# Altium schematic sheet DCDC_Hall.SchDoc
size 420 x 297 mm; Address1: Address1; Address2: Address2; Address3: Address3; Address4: Address4; SheetNumber: 1; Scale: 1:1; Разраб.: Иванов; Обозначение документа: АБВГ.123456.001 Э3; Пров.: Петров; Утв.: Сидоров; Наименование организации: ОАО "Концерн "МПО-Гидроприбор"; Перв. применение: АБВГ.123456.000; Наименование изделия 1: Плата; Наименование изделия 2: Схема электрическая; Наименование изделия 3: принципиальная; Нач. отд.: Нач. отд.; Фамилия нач. отд.: Сидоров
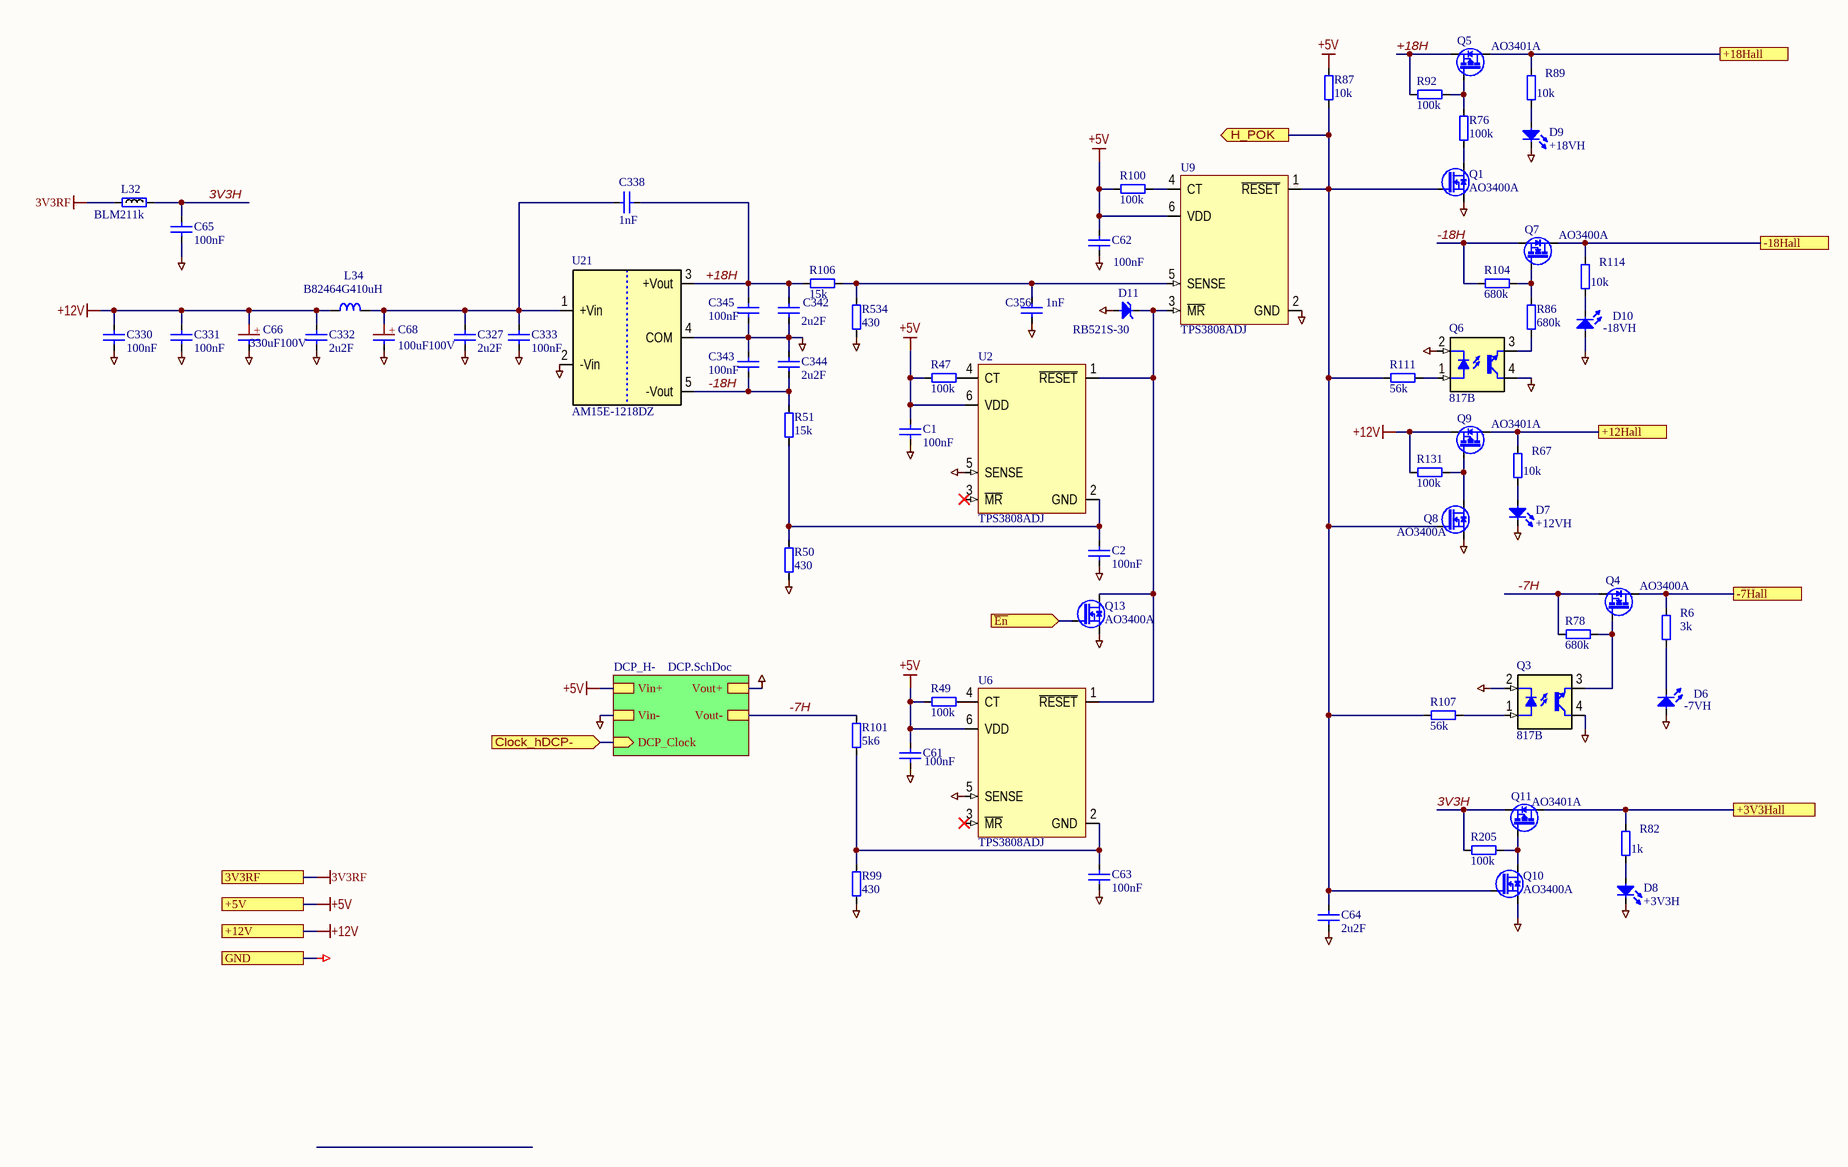
[diagram p0: DCDC_Hall.SchDoc]

## Parts
C1  100nF  [SMD0805CAP]
C2  100nF  [SMD0805CAP]
C61  100nF  [SMD0805CAP]
C62  100nF  [SMD0805CAP]
C63  100nF  [SMD0805CAP]
C64  2u2F  [SMD0805CAP]
C65  100nF  [SMD0805CAP]
C66  330uF100V  [CAPPR750-1600X2000]
C68  100uF100V  [CAPPR500-1000X1250]
C327  2u2F  [SMD0805CAP]
C330  100nF  [SMD0805CAP]
C331  100nF  [SMD0805CAP]
C332  2u2F  [SMD0805CAP]
C333  100nF  [SMD0805CAP]
C338  1nF  [SMD0805CAP]
C342  2u2F  [SMD0805CAP]
C343  100nF  [SMD0805CAP]
C344  2u2F  [SMD0805CAP]
C345  100nF  [SMD0805CAP]
C356  1nF  [SMD0805CAP]
D6  -7VH  [LED0603]
D7  +12VH  [LED0603]
D8  +3V3H  [LED0603]
D9  +18VH  [LED0603]
D10  -18VH  [LED0603]
D11  RB521S-30  [SODFL1608X65N]
L32  BLM211k  [RESC2012X50N]
L34  B82464G410uH  [IND_COILCRAFT_MSS1038]
Q1  AO3400A  [SOT95P229X119-3N]
Q3  817B  [DIP4-300]
Q4  AO3400A  [SOT95P229X119-3N]
Q5  AO3401A  [SOT95P229X119-3N]
Q6  817B  [DIP4-300]
Q7  AO3400A  [SOT95P229X119-3N]
Q8  AO3400A  [SOT95P229X119-3N]
Q9  AO3401A  [SOT95P229X119-3N]
Q10  AO3400A  [SOT95P229X119-3N]
Q11  AO3401A  [SOT95P229X119-3N]
Q13  AO3400A  [SOT95P229X119-3N]
R6  3k  [SMD0805RES]
R47  100k  [SMD0805RES]
R49  100k  [SMD0805RES]
R50  430  [SMD0805RES]
R51  15k  [SMD0805RES]
R67  10k  [SMD0805RES]
R76  100k  [SMD0805RES]
R78  680k  [SMD0805RES]
R82  1k  [SMD0805RES]
R86  680k  [SMD0805RES]
R87  10k  [SMD0805RES]
R89  10k  [SMD0805RES]
R92  100k  [SMD0805RES]
R99  430  [SMD0805RES]
R100  100k  [SMD0805RES]
R101  5k6  [SMD0805RES]
R104  680k  [SMD0805RES]
R106  15k  [SMD0805RES]
R107  56k  [SMD0805RES]
R111  56k  [SMD0805RES]
R114  10k  [SMD0805RES]
R131  100k  [SMD0805RES]
R205  100k  [SMD0805RES]
R534  430  [SMD0805RES]
U2  TPS3808ADJ  [SOT95P270X145-6N]
U6  TPS3808ADJ  [SOT95P270X145-6N]
U9  TPS3808ADJ  [SOT95P270X145-6N]
U21  AM15E-1218DZ  [DCDC_Aimtec_Dual]

## Sub-sheets
DCP_H- = DCP.SchDoc: DCP_Clock (in), Vout+, Vout-, Vin-, Vin+

## Ports
3V3RF, +3V3Hall, +5V, +12Hall, +12V, +18Hall, -7Hall, -18Hall, Clock_hDCP- (in), GND, H_POK (out), ~{En} (in)

## Nets
3V3RF: L32.2 ; port 3V3RF
+5V: C1.2 C61.2 C62.2 R47.1 R49.1 R87.1 R100.1 U2.6(VDD) U6.6(VDD) U9.6(VDD) ; port +5V, sheet DCP_H-/Vin+
+12V: C66.1(+) C330.2 C331.2 C332.2 L34.1 Q9.2(S) R131.2 ; port +12V
GND: C1.1 C2.2 C61.1 C62.1 C63.2 C64.2 C65.1 C66.2 C68.2 C327.1 C330.1 C331.1 C332.1 C333.2 C342.1 C343.1 C344.2 C345.2 C356.1 D6.2(A) D7.1(C) D8.1(C) D9.1(C) D10.2(A) D11.2(A) Q1.2(S) Q3.2(C) Q3.4(C) Q6.2(C) Q6.4(C) Q8.2(S) Q10.2(S) Q13.2(S) R50.1 R99.1 R534.1 U2.5(SENSE) U6.5(SENSE) U9.2(GND) U21.2(-Vin) U21.4(COM) ; port GND, sheet DCP_H-/Vout+, sheet DCP_H-/Vin-
3V3H: C65.2 L32.1 Q11.2(S) R205.2
+3V3Hall: Q11.3(D) R82.2 ; port +3V3Hall
+12Hall: Q9.3(D) R67.2 ; port +12Hall
+18H: C338.2 C342.2 C345.1 Q5.2(S) R92.2 R106.2 U21.3(+Vout)
+18Hall: Q5.3(D) R89.2 ; port +18Hall
-7H: Q4.2(S) R78.2 R101.1 ; sheet DCP_H-/Vout-
-7Hall: Q4.3(D) R6.2 ; port -7Hall
-18H: C343.2 C344.1 Q7.2(S) R51.1 R104.2 U21.5(-Vout)
-18Hall: Q7.3(D) R114.2 ; port -18Hall
~{En}: Q13.1(G) ; port ~{En}
Clock_hDCP-: port Clock_hDCP-, sheet DCP_H-/DCP_Clock
H_POK: C64.1 Q1.1(G) Q8.1(G) Q10.1(G) R87.2 R107.1 R111.1 U9.1(~{RESET}) ; port H_POK
NetC2_1: C2.1 R50.2 R51.2 U2.2(GND)
NetC63_1: C63.1 R99.2 R101.2 U6.2(GND)
NetC68_1: C68.1(+) C327.2 C333.1 C338.1 L34.2 U21.1(+Vin)
NetC356_2: C356.2 R106.1 R534.2 U9.5(SENSE)
NetD6_1: D6.1(C) R6.1
NetD7_2: D7.2(A) R67.1
NetD8_2: D8.2(A) R82.1
NetD9_2: D9.2(A) R89.1
NetD10_1: D10.1(C) R114.1
NetD11_1: D11.1(C) Q13.3(D) U2.1(~{RESET}) U6.1(~{RESET}) U9.3(~{MR})
NetQ1_3: Q1.3(D) R76.1
NetQ3_1: Q3.1(A) R107.2
NetQ3_3: Q3.3(E) Q4.1(G) R78.1
NetQ5_1: Q5.1(G) R76.2 R92.1
NetQ6_1: Q6.1(A) R111.2
NetQ6_3: Q6.3(E) R86.1
NetQ7_1: Q7.1(G) R86.2 R104.1
NetQ8_3: Q8.3(D) Q9.1(G) R131.1
NetQ10_3: Q10.3(D) Q11.1(G) R205.1
NetR47_2: R47.2 U2.4(CT)
NetR49_2: R49.2 U6.4(CT)
NetR100_2: R100.2 U9.4(CT)

Not connected (* = marked no-connect by the designer): U2 3(~{MR})*; U6 3(~{MR})*

## Notes on the sheet
- Подп. и дата
- Инв. № дубл.
- Взам. инв. №
- Инв. № подл.
- Изм.
- Лист
- № докум.
- Подп.
- Дата
- Копировал
- Формат А3

## Library data of the parts
C1 C2 C61-C65 C327 C330-C333 C338 C342-C345 C356 = C0805: Чип конденсатор 0805; Voltage: 25V; Vendor: Vishay; DielectricType: X5R; SMD Solders: 2; Solder Option: RM; Tolerance: 20%; Pkg: SMD0805; Device: Cap0805; Price: 2
  C1 C2 C61-C63 C65 C330 C331 C333 C343 C345: Value: 100nF
  C64 C327 C332 C342 C344: Value: 2u2F
  C338 C356: Value: 1nF
C66 = CAP_POL_7_5x16: Конденсатор полярный d16 p7.5мм; Voltage: 100V; Vendor: Vishay; Value: 330uF; SMD Solders: 0; Solder Option: RM; Tolerance: 20%; Pkg: 7.5x16mm; Device: Cap+; THD Solders: 2; Price: 30
C68 = CAP_POL_5x10: Конденсатор полярный d10 p5мм; Voltage: 100V; Vendor: Vishay; Value: 100uF; SMD Solders: 0; Solder Option: RM; Tolerance: 20%; Pkg: 5x10mm; Device: Cap+; THD Solders: 2; Price: 20
D6-D10 = LED0603: Чип светодиод 0603; Vendor: KB; SMD Solders: 2; Solder Option: RM; Pkg: SMD0603; Price: 10; Device: LED0603
  D6: Value: -7VH
  D7: Value: +12VH
  D8: Value: +3V3H
  D9: Value: +18VH
  D10: Value: -18VH
D11 = RB521S-30: Чип Шоттки диод; Vendor: CTK; Voltage: 30V; SMD Solders: 2; Solder Option: RM; Pkg: SOD523; Price: 5; Device: RB521S-30; Name to order: RB521S-30
L32 = BLM21: SMD Ferrite bead 0805; Vendor: Vishay; Value: 1k; Pkg: SMD0805; SMD Solders: 2; Solder Option: RM; Price: 10; Device: BLM21
L34 = B82464G4: SMD Дроссель; Vendor: Epcos; Value: 10uH; Voltage: 2; Solder Option: RM; Tolerance: 20%; Pkg: SMD10.4x10.4mm; THD Solders: 0; Name to order: B82464G4103M; Current: 3A5; Price: 400; SMD Solders: 2; Device: B82464G4
Q1 Q4 Q7 Q8 Q10 Q13 = AO3400A: NMOS; Vendor: UMW; Pkg: SOT23; SMD Solders: 3; Solder Option: RM; Voltage: 30V; Price: 10; Device: AO3400A; Name to order: AO3400A
Q3 Q6 = 817B: Optotransistor; Pkg: DIP4; SMD Solders: 0; Solder Option: RM; THD Solders: 4; Vendor: UMW; Voltage: 35V; Device: 817B; Price: 10; Name to order: 817B; Current: 0
Q5 Q9 Q11 = AO3401A: PMOS; Vendor: UMW; Pkg: SOT23; SMD Solders: 3; Solder Option: RM; THD Solders: 0; Voltage: -30V; Price: 10; Device: AO3401A; Name to order: AO3401A
R6 R47 R49-R51 R67 R76 R78 R82 R86 R87 R89 R92 R99-R101 R104 R106 R107 R111 R114 R131 R205 R534 = R0805: Чип резистор 0805; Vendor: Vishay; SMD Solders: 2; Solder Option: RM; TC: 100ppm/C; Tolerance: 1%; Pkg: SMD0805; Pwr: 125mW; Device: Res0805; Price: 2
  R6: Value: 3k
  R47 R49 R76 R92 R100 R131 R205: Value: 100k
  R50 R99 R534: Value: 430
  R51 R106: Value: 15k
  R67 R87 R89 R114: Value: 10k
  R78 R86 R104: Value: 680k
  R82: Value: 1k
  R101: Value: 5k6
  R107 R111: Value: 56k
U2 U6 U9 = TPS3808: Supervisory Circuit. Low-Quiescent-Current, Programmable-Delay; Vendor: Texas Instruments; Value: ADJ; Pkg: SOT23-6; SMD Solders: 6; Solder Option: RM; THD Solders: 0; Name to order: TPS3808G01DBV; Current: 6uA; thVoltage: 400mV; Price: 200; Device: TPS3808
U21 = AM15E-: DC-DC+&-Halvoisolated out; Vendor: Aimtec; Value: 1218DZ; Pkg: DCDC_5; SMD Solders: 0; Solder Option: RM; THD Solders: 5; Name to order: AM15-1218DZ; Price: 2000; Device: AM15E-